# Altium schematic sheet Input_amplifiers.SchDoc: Input signal amplifiers
size A4; Engineer: Matjaž Tome; Revision: B; SheetNumber: 7; SheetTotal: 10
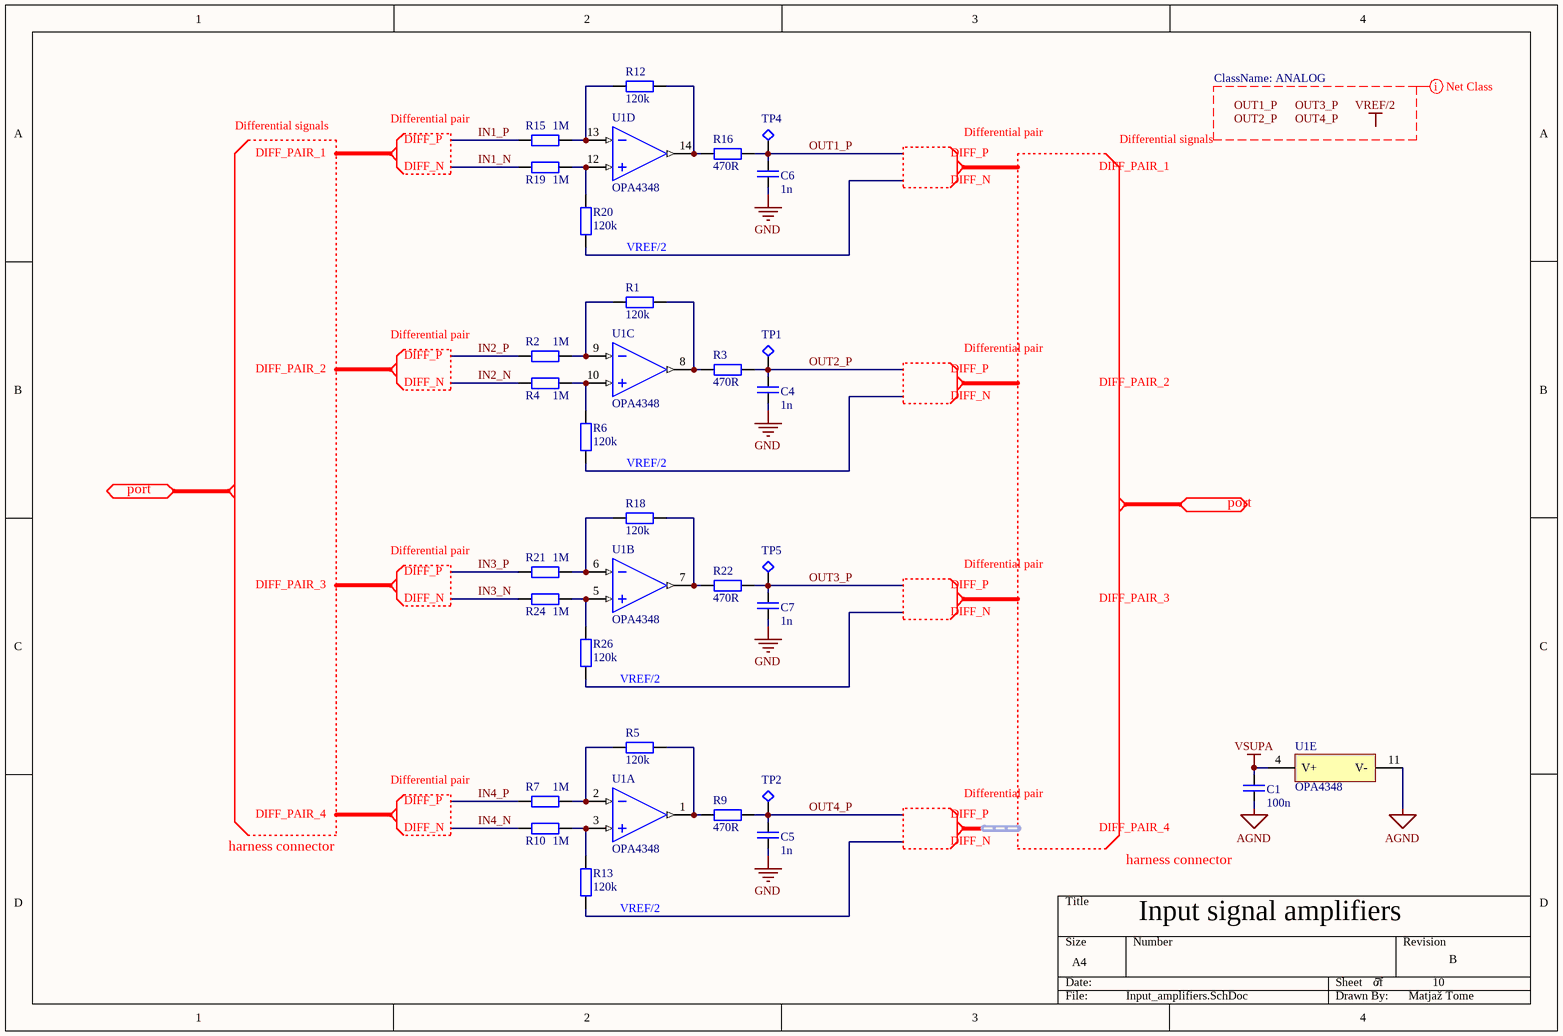
[diagram p0: Input_amplifiers.SchDoc]

## Parts
C1  100n  [C_0603]
C4  1n  [C_0603]
C5  1n  [C_0603]
C6  1n  [C_0603]
C7  1n  [C_0603]
R1  120k  [R_0603]
R2  1M  [R_0603]
R3  470R  [R_0603]
R4  1M  [R_0603]
R5  120k  [R_0603]
R6  120k  [R_0603]
R7  1M  [R_0603]
R9  470R  [R_0603]
R10  1M  [R_0603]
R12  120k  [R_0603]
R13  120k  [R_0603]
R15  1M  [R_0603]
R16  470R  [R_0603]
R18  120k  [R_0603]
R19  1M  [R_0603]
R20  120k  [R_0603]
R21  1M  [R_0603]
R22  470R  [R_0603]
R24  1M  [R_0603]
R26  120k  [R_0603]
TP1  testpoint  [TP1_FULL]  (value not drawn)
TP2  testpoint  [TP1_FULL]  (value not drawn)
TP4  testpoint  [TP1_FULL]  (value not drawn)
TP5  testpoint  [TP1_FULL]  (value not drawn)
U1  OPA4348  (parts A,B,C,D,E of 5)

## Nets
AGND: C1.1 U1.11(V-)
GND: C4.2 C5.2 C6.2 C7.2
VSUPA: C1.2 U1.4(V+)
IN1_N: R19.1
IN1_P: R15.1
IN2_N: R4.1
IN2_P: R2.1
IN3_N: R24.1
IN3_P: R21.1
IN4_N: R10.1
IN4_P: R7.1
OUT1_P: C6.1 R16.2 TP4.1
OUT2_P: C4.1 R3.2 TP1.1
OUT3_P: C7.1 R22.2 TP5.1
OUT4_P: C5.1 R9.2 TP2.1
NetR1_1: R1.1 R2.2 U1.9(-IN_C)
NetR1_2: R1.2 R3.1 U1.8(OUT_C)
NetR4_2: R4.2 R6.2 U1.10(+IN_C)
NetR5_1: R5.1 R7.2 U1.2(-IN_A)
NetR5_2: R5.2 R9.1 U1.1(OUT_A)
NetR10_2: R10.2 R13.2 U1.3(+IN_A)
NetR12_1: R12.1 R15.2 U1.13(-IN_D)
NetR12_2: R12.2 R16.1 U1.14(OUT_D)
NetR18_1: R18.1 R21.2 U1.6(-IN_B)
NetR18_2: R18.2 R22.1 U1.7(OUT_B)
NetR19_2: R19.2 R20.2 U1.12(+IN_D)
NetR24_2: R24.2 R26.2 U1.5(+IN_B)

Not connected (* = marked no-connect by the designer): R6 1; R13 1; R20 1; R26 1

## Layout directives
net class ANALOG: OUT1_P, OUT2_P, OUT3_P, OUT4_P, VREF/2

## Notes on the sheet
- Differential signals
- DIFF_PAIR_1
- Differential pair
- DIFF_P
- DIFF_N
- VREF/2
- DIFF_PAIR_2
- port
- DIFF_PAIR_3
- (near R26) VREF/2
- harness connector
- DIFF_PAIR_4
- (near R13) VREF/2
- Labels drawn without touching a wire or pin: OUT1_P, OUT2_P, OUT3_P, OUT4_P, VREF/2

## Library data of the parts
C1 C4-C7 = Capacitor: Generic capacitor
  C1: Value: 100n
  C4-C7: Value: 1n
R1-R7 R9 R10 R12 R13 R15 R16 R18-R22 R24 R26 = Resistor: Generic resistor
  R1 R5 R6 R12 R13 R18 R20 R26: Value: 120k
  R2 R4 R7 R10 R15 R19 R21 R24: Value: 1M
  R3 R9 R16 R22: Value: 470R
TP1 TP2 TP4 TP5 = Test Point: testpoint 1.5mm diameter no hole; Part Number: XXC0006; Category: testpoints
U1 = OPA4348: 1MHz, 45µA, CMOS, Rail-to-Rail OPERATIONAL AMPLIFIERS Value Line Series; Part Number: XOG0008; Manufacturer: Texas Instruments; Manufacturer Number: OPA4348AID; Dealer number: 2323277; Dealer: Farnell; Supply voltage max: 5.5V; Supply voltage min: 2.1V; Devices: 4; Rail to Rail: IN/OUT; Category: Integrated circuits; Price: 1.64; GBP: 1MHz; Case: SOIC14; Technology: SMT; HelpURL: http://www.ti.com/general/docs/suppproductinfo.tsp?distId=26&gotoUrl=http%3A%2F%2Fwww.ti.com%2Flit%2Fgpn%2Fopa4348